# Altium schematic sheet [03] - Decoders.SchDoc
size A4
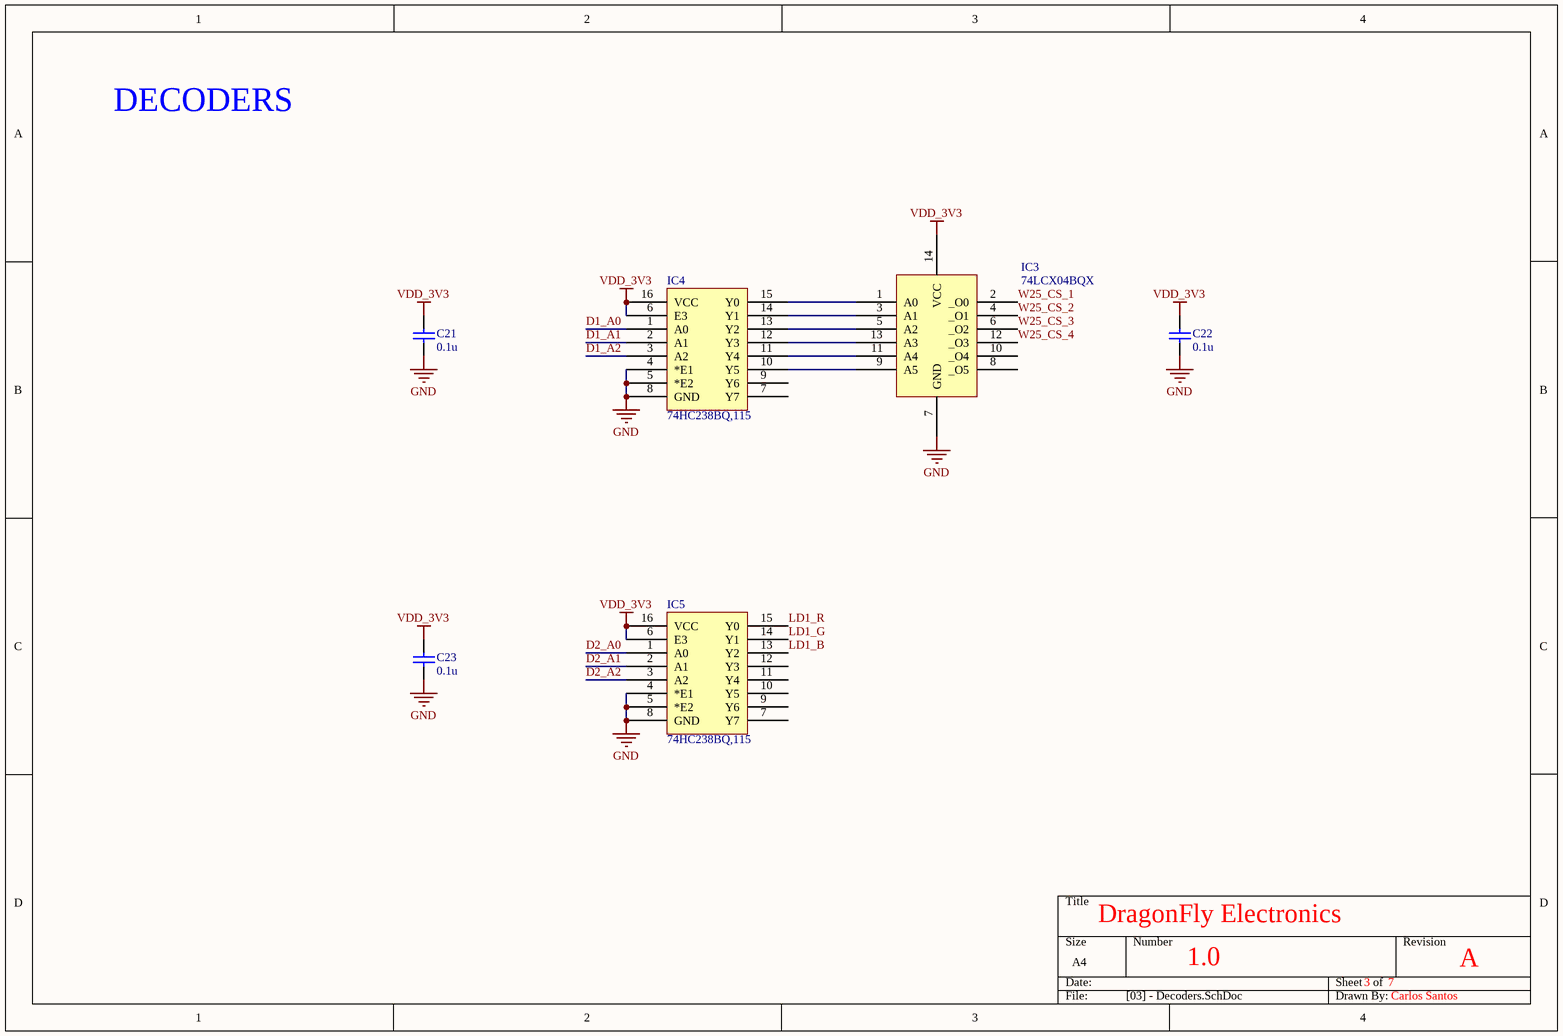
[diagram p0: [03] - Decoders.SchDoc]

## Parts
C21  value 0.1u  [0402 - Capacitor]  (hidden comment: Capacitor)
C22  value 0.1u  [0402 - Capacitor]  (hidden comment: Capacitor)
C23  value 0.1u  [0402 - Capacitor]  (hidden comment: Capacitor)
IC3  74LCX04BQX  [74LCX04BQXFSCT - QFN]
IC4  74HC238BQ,115  [QFN127P600-8N]
IC5  74HC238BQ,115  [QFN127P600-8N]

## Nets
GND: C21.1 C22.1 C23.1 IC3.7(GND) IC4.4(*E1) IC4.5(*E2) IC4.8(GND) IC5.4(*E1) IC5.5(*E2) IC5.8(GND)
VDD_3V3: C21.2 C22.2 C23.2 IC3.14(VCC) IC4.6(E3) IC4.16(VCC) IC5.6(E3) IC5.16(VCC)
D1_A0: IC4.1(A0)
D1_A1: IC4.2(A1)
D1_A2: IC4.3(A2)
D2_A0: IC5.1(A0)
D2_A1: IC5.2(A1)
D2_A2: IC5.3(A2)
LD1_B: IC5.13(Y2)
LD1_G: IC5.14(Y1)
LD1_R: IC5.15(Y0)
W25_CS_1: IC3.2(_O0)
W25_CS_2: IC3.4(_O1)
W25_CS_3: IC3.6(_O2)
W25_CS_4: IC3.12(_O3)
NetIC3_1: IC3.1(A0) IC4.15(Y0)
NetIC3_3: IC3.3(A1) IC4.14(Y1)
NetIC3_5: IC3.5(A2) IC4.13(Y2)
NetIC3_9: IC3.9(A5) IC4.10(Y5)
NetIC3_11: IC3.11(A4) IC4.11(Y4)
NetIC3_13: IC3.13(A3) IC4.12(Y3)

Not connected (* = marked no-connect by the designer): IC3 8(_O5) 10(_O4); IC4 7(Y7) 9(Y6); IC5 7(Y7) 9(Y6) 10(Y5) 11(Y4) 12(Y3)

## Notes on the sheet
- DECODERS
- DragonFly Electronics
- 1.0
- 3
- 7
- A
- Carlos Santos

## Library data of the parts
IC3 = 74LCX04BQX: DigiKey Part #: 74LCX04BQXFSCT-ND
IC4 IC5 = 74HC238BQ,115: DigiKey Part #: 1727-6909-1-ND